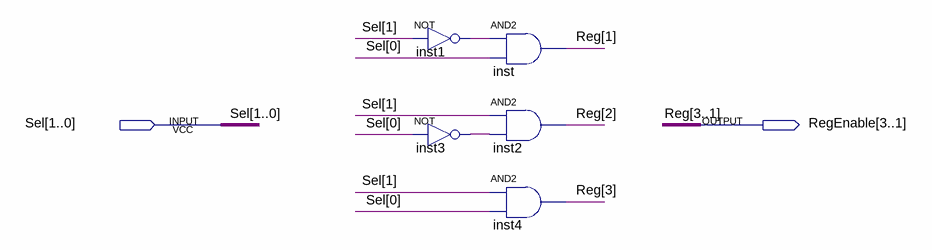
[diagram p0: schematic sheet]
// Quartus schematic EnableRegMux.bdf as structural Verilog: 5 symbols, 2 pins
module EnableRegMux (
  input  [1:0] Sel,
  output [3:1] RegEnable
);

  wire inst1_out, inst3_out;

  not inst1 (inst1_out, Sel[1]);
  not inst3 (inst3_out, Sel[0]);
  and inst (RegEnable[1], inst1_out, Sel[0]);
  and inst2 (RegEnable[2], Sel[1], inst3_out);
  and inst4 (RegEnable[3], Sel[1], Sel[0]);

  // Other names for the same wires on the sheet: Reg[3:1] = RegEnable
endmodule
